# EAGLE schematic OLM_OS_v142 (EAGLE 6.4)
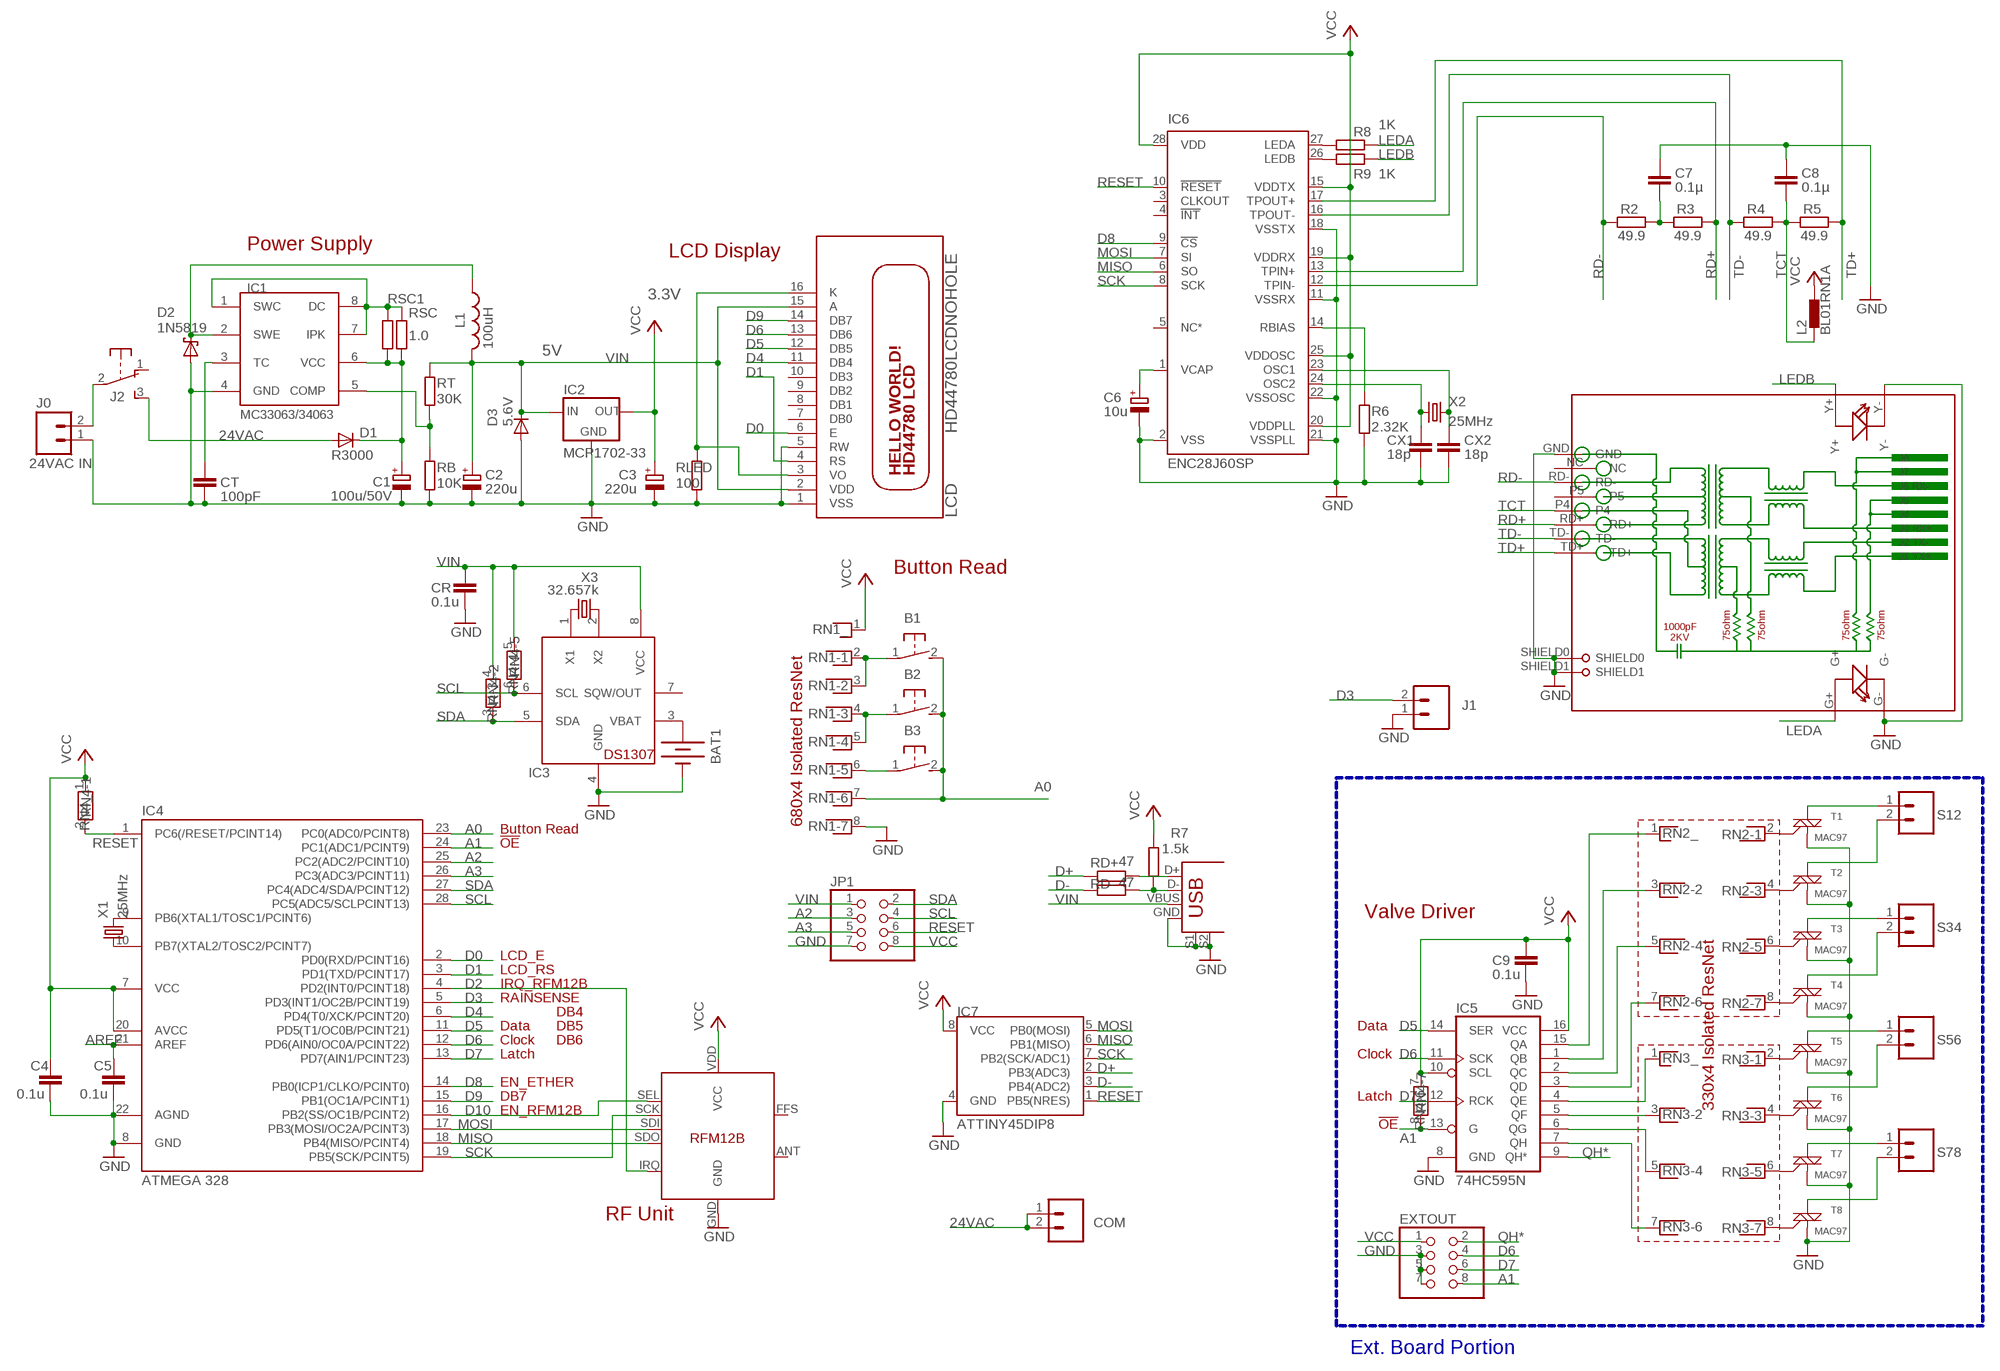
[diagram p0: schematic, sheet 1]

## Parts
B1  31-XX  [B3F-31XX]
B2  31-XX  [B3F-31XX]
B3  31-XX  [B3F-31XX]
BAT1  BATTERY12PTH  [BATTCON_12MM_PTH]
C1  100u/50V  CPOL-EUE3.5-8  [E3,5-8]
C2  220u  CPOL-EUE2-5  [E2-5]
C3  220u  CPOL-EUE2-5  [E2-5]
C4  0.1u  C-EU025-024X044  [C025-024X044]
C5  0.1u  C-EU025-024X044  [C025-024X044]
C6  10u  CPOL-EUE1.8-4  [E1,8-4]
C7  0.1µ  C-EU025-024X044  [C025-024X044]
C8  0.1µ  C-EU025-024X044  [C025-024X044]
C9  0.1u  C-EU025-024X044  [C025-024X044]
COM  M025MM  [SCREWTERMINAL-5MM-2]
CR  0.1u  C-EU025-024X044  [C025-024X044]
CT  100pF  C-EU025-024X044  [C025-024X044]
CX1  18p  C-EU025-024X044  [C025-024X044]
CX2  18p  C-EU025-024X044  [C025-024X044]
D1  R3000  DIODE-DO41-7.6  [DO41-7.6]
D2  1N5819  1N5817-B  [DO41-7.6]
D3  5.6V  1N4148DO35-7  [DO35-7]
EXTOUT  PINHD-2X4  [2X04]
IC1  MC33063/MC34063P  [DIL08]
IC2  MCP1702-33  MCP1700INLINE  [TO92-INLINE]
IC3  DS1307  [DIL08]
IC4  ATMEGA 328  ATMEGA48/88/168-PU  [DIL28-3]
IC5  74HC595N  74LS595N  [DIL16]
IC6  ENC28J60SP  [DIL28-3]
IC7  ATTINY45DIP8  [DIP08]
IC8  RFM12B  [RFM12B]
J0  24VAC IN  M025MM  [SCREWTERMINAL-5MM-2]
J1  M025MM  [SCREWTERMINAL-5MM-2]
J2  EG1206  [EG1206]
JP1  PINHD-2X4  [2X04]
L1  100uH  L-US6000-XXX-RC  [6000-XXXX-RC]
L2  BL01RN1A  [BL01RN1A]
LCD  HD44780LCDNOHOLE  [LCD1602A]
R2  49.9  R-EU_0204/7  [0204/7]
R3  49.9  R-EU_0204/7  [0204/7]
R4  49.9  R-EU_0204/7  [0204/7]
R5  49.9  R-EU_0204/7  [0204/7]
R6  2.32K  R-EU_0204/7  [0204/7]
R7  1.5k  R-EU_0204/7  [0204/7]
R8  1K  R-EU_0204/7  [0204/7]
R9  1K  R-EU_0204/7  [0204/7]
RB  10K  R-EU_0204/7  [0204/7]
RD+  47  R-EU_0204/7  [0204/7]
RD-  47  R-EU_0204/7  [0204/7]
RJ1  HR911105A  [HR911105A]
RLED  100  R-EU_0204/7  [0204/7]
RN1  RNX7  [RN-8]
RN2  RNX7  [RN-8]
RN3  RNX7  [RN-8]
RN4  RNX7  [RN-8]
RSC  1.0  R-EU_0204/7  [0204/7]
RSC1  1.0  R-EU_0204/7  [0204/7]
RT  30K  R-EU_0204/7  [0204/7]
S12  M025MM  [SCREWTERMINAL-5MM-2]
S34  M025MM  [SCREWTERMINAL-5MM-2]
S56  M025MM  [SCREWTERMINAL-5MM-2]
S78  M025MM  [SCREWTERMINAL-5MM-2]
T1  MAC97  LX807DE  [TO-92]
T2  MAC97  LX807DE  [TO-92]
T3  MAC97  LX807DE  [TO-92]
T4  MAC97  LX807DE  [TO-92]
T5  MAC97  LX807DE  [TO-92]
T6  MAC97  LX807DE  [TO-92]
T7  MAC97  LX807DE  [TO-92]
T8  MAC97  LX807DE  [TO-92]
USB  USB+SHIELD  [USB-B-PTH]
X1  25MHz  CRYSTALHC49US  [HC49US]
X2  25MHz  CRYSTALHC49US  [HC49US]
X3  32.657k  CRYSTALTC26H  [TC26H]

## Nets
24VAC [power]: COM.1 COM.2 D1.A J2.3(S)
A0: B1.2(S) B2.2(S) B3.2(S) IC4.23(PC0(ADC0/PCINT8)) RN1.7
A1: EXTOUT.8 IC4.24(PC1(ADC1/PCINT9)) IC5.13(G) RN4.8
A2: IC4.25(PC2(ADC2/PCINT10)) JP1.3
A3: IC4.26(PC3(ADC3/PCINT11)) JP1.5
AREF: C5.1 IC4.21(AREF)
D0: IC4.2(PD0(RXD/PCINT16)) LCD.6(E)
D1: IC4.3(PD1(TXD/PCINT17)) LCD.4(RS)
D2: IC4.4(PD2(INT0/PCINT18)) IC8.IRQ
D3: IC4.5(PD3(INT1/OC2B/PCINT19)) J1.2
D4: IC4.6(PD4(T0/XCK/PCINT20)) LCD.11(DB4)
D5: IC4.11(PD5(T1/OC0B/PCINT21)) IC5.14(SER) LCD.12(DB5)
D6: EXTOUT.4 IC4.12(PD6(AIN0/OC0A/PCINT22)) IC5.11(SCK) LCD.13(DB6)
D7: EXTOUT.6 IC4.13(PD7(AIN1/PCINT23)) IC5.12(RCK)
D8: IC4.14(PB0(ICP1/CLKO/PCINT0)) IC6.9(!CS)
D9: IC4.15(PB1(OC1A/PCINT1)) LCD.14(DB7)
D10: IC4.16(PB2(SS/OC1B/PCINT2)) IC8.SEL
D+: IC7.2(PB3(ADC3)) RD+.1
D-: IC7.3(PB4(ADC2)) RD-.1
GND [power]: BAT1.GND(-) C1.- C2.- C3.- C4.2 C5.2 C6.- C7.1 C8.1 C9.2 CR.2 CT.2 CX1.2 CX2.2 D2.A D3.A EXTOUT.3 EXTOUT.5 EXTOUT.7 IC1.4(GND) IC2.1(GND) IC3.4(GND) IC4.8(GND) IC4.22(AGND) IC5.8(GND) IC6.2(VSS) IC6.11(VSSRX) IC6.18(VSSTX) IC6.21(VSSPLL) IC6.22(VSSOSC) IC7.4(GND) IC8.GND J0.1 J1.1 JP1.7 LCD.1(VSS) LCD.5(RW) R6.2 RB.2 RJ1.G- RJ1.GND RJ1.SHIELD0 RJ1.SHIELD1 RJ1.Y- RLED.2 RN1.8 T1.1(M1) T2.1(M1) T3.1(M1) T4.1(M1) T5.1(M1) T6.1(M1) T7.1(M1) T8.1(M1) USB.GND USB.S1 USB.S2
LEDA: R8.2 RJ1.G+
LEDB: R9.2 RJ1.Y+
MISO: IC4.18(PB4(MISO/PCINT4)) IC6.6(SO) IC7.6(PB1(MISO)) IC8.SDO
MOSI: IC4.17(PB3(MOSI/OC2A/PCINT3)) IC6.7(SI) IC7.5(PB0(MOSI)) IC8.SDI
N$2: IC4.9(PB6(XTAL1/TOSC1/PCINT6)) X1.2
N$3: RN2.2 T1.2(G)
N$4: IC5.5(QF) RN3.3
N$5: IC5.6(QG) RN3.5
N$6 [power]: J0.2 J2.2(P)
N$7: IC5.7(QH) RN3.7
N$8: IC4.10(PB7(XTAL2/TOSC2/PCINT7)) X1.1
N$9 [power]: C1.+ D1.C IC1.6(VCC) RSC1.2 RSC.2
N$10: IC5.4(QE) RN3.1
N$11: IC5.3(QD) RN2.7
N$12: IC5.2(QC) RN2.5
N$13: IC5.1(QB) RN2.3
N$14: IC5.15(QA) RN2.1
N$15: RN2.4 T2.2(G)
N$16 [power]: S12.1 T1.3(M2)
N$17 [power]: S12.2 T2.3(M2)
N$18 [power]: S34.1 T3.3(M2)
N$19: RN2.6 T3.2(G)
N$20 [power]: S34.2 T4.3(M2)
N$21: RN2.8 T4.2(G)
N$22 [power]: S56.1 T5.3(M2)
N$23 [power]: S56.2 T6.3(M2)
N$24 [power]: S78.1 T7.3(M2)
N$25 [power]: S78.2 T8.3(M2)
N$26: RN3.2 T5.2(G)
N$27: RN3.4 T6.2(G)
N$28: RN3.6 T7.2(G)
N$29: RN3.8 T8.2(G)
N$32: B1.1(P) RN1.2 RN1.3
N$33: B3.1(P) RN1.6
N$35: B2.1(P) RN1.4 RN1.5
N$36: BAT1.VCC@1(+) IC3.3(VBAT)
N$37: IC6.27(LEDA) R8.1
N$38: RD+.2 USB.D+
N$39: IC6.26(LEDB) R9.1
N$40 [power]: IC1.1(SWC) IC1.7(IPK) IC1.8(DC) RSC1.1 RSC.1
N$45: R7.1 RD-.2 USB.D-
N$46 [power]: D2.C IC1.2(SWE) L1.1
N$47: IC3.2(X2) X3.2
N$48: LCD.3(VO) LCD.16(K) RLED.1
N$49: CT.1 IC1.3(TC)
N$50: C6.+ IC6.1(VCAP)
N$51: IC6.14(RBIAS) R6.1
N$52: CX1.1 IC6.24(OSC2) X2.1
N$53: CX2.1 IC6.23(OSC1) X2.2
N$54: C7.2 R2.2 R3.1
N$55: IC1.5(COMP) RB.1 RT.2
N$57: IC3.1(X1) X3.1
QH*: EXTOUT.2 IC5.9(QH*)
RD+: IC6.13(TPIN+) R3.2 RJ1.RD+
RD-: IC6.12(TPIN-) R2.1 RJ1.RD-
RESET: IC4.1(PC6(/RESET/PCINT14)) IC6.10(!RESET) IC7.1(PB5(NRES)) JP1.6 RN4.2
SCK: IC4.19(PB5(SCK/PCINT5)) IC6.8(SCK) IC7.7(PB2(SCK/ADC1)) IC8.SCK
SCL: IC3.6(SCL) IC4.28(PC5(ADC5/SCLPCINT13)) JP1.4 RN4.6
SDA: IC3.5(SDA) IC4.27(PC4(ADC4/SDA/PCINT12)) JP1.2 RN4.3
TCT: C8.2 L2.1 R4.2 R5.1 RJ1.P4
TD+: IC6.17(TPOUT+) R5.2 RJ1.TD+
TD-: IC6.16(TPOUT-) R4.1 RJ1.TD-
VCC: C3.+ C4.1 C9.1 EXTOUT.1 IC2.3(OUT) IC4.7(VCC) IC4.20(AVCC) IC5.10(SCL) IC5.16(VCC) IC6.15(VDDTX) IC6.19(VDDRX) IC6.20(VDDPLL) IC6.25(VDDOSC) IC6.28(VDD) IC7.8(VCC) IC8.VDD(VCC) JP1.8 L2.2 R7.2 RN1.1 RN4.1 RN4.7
VIN [power]: C2.+ CR.1 D3.C IC2.2(IN) IC3.8(VCC) JP1.1 L1.2 LCD.2(VDD) LCD.15(A) RN4.4 RN4.5 RT.1 USB.VBUS
Unconnected: IC3.7(SQW/OUT) IC6.3(CLKOUT) IC6.4(!INT) IC6.5(NC*) IC8.ANT IC8.FFS J2.1(O) LCD.7(DB0) LCD.8(DB1) LCD.9(DB2) LCD.10(DB3) RJ1.NC RJ1.P5

## Buses
B$1

## Notes on the sheet
- Power Supply
- LCD Display
- 3.3V
- 5V
- Button Read
- 680x4 Isolated ResNet
- Button Read
- !OE
- Valve Driver
- 330x4 Isolated ResNet
- LCD_E
- LCD_RS
- IRQ_RFM12B
- RAINSENSE
- DB4
- Data | DB5 | Data
- Clock | DB6
- Latch | Clock
- EN_ETHER
- DB7 | Latch
- EN_RFM12B
- !OE
- RF Unit
- Ext. Board Portion

## Library data of the parts
B1-B3 = adafruit:31-XX: OMRON SWITCH Now with beefier pads!
BAT1 = SparkFun:BATTERY: Battery Holders Various common sizes : AA, AAA, 20mm coin cell and 12mm coin cell.
C1-C3 C6 = resistor:CPOL-EU: POLARIZED CAPACITOR, European symbol
C4 C5 C9 CR CT = rcl:C-EU: CAPACITOR, European symbol
C7 C8 CX1 CX2 = resistor:C-EU: CAPACITOR, European symbol
COM J0 J1 S12 S34 S56 S78 = SparkFun:M02: Header 2 Standard 2-pin 0.1" header. Use with straight break away headers (SKU : PRT-00116), right angle break away headers (PRT-00553), swiss pins (PRT-00743), machine pins (PRT-00117), and female headers (PRT-00115). Molex polarized connector foot print use with SKU : PRT-08233 with associated crimp pins and housings.
D1 = diode:DIODE-: DIODE
D2 = diode:1N581*: 1.0A SCHOTTKY BARRIER RECTIFIER Source: http://www.diodes.com/datasheets/ds23001.pdf
D3 = diode:1N4148: DIODE high speed (Philips)
EXTOUT JP1 = pinhead:PINHD-2X4: PIN HEADER
IC1 = adafruit:MC33063/MC34063: MC33063 and MC34063 Basic DC/DC converter with internal power-NPN transistor, 100KHz, 1.5A peak switch current. 3-40 input/output.
IC2 = adafruit:MCP1700: VOLTAGE REGULATOR
IC3 = adafruit:DS1307: DS1307 Real time clock (RTC) with battery backup ability. Talk to it via i2c
IC4 = atmega8:ATMEGA48/88/168-PU
IC5 = SparkFun:74*595: 8-bit SHIFT REGISTER, output latch
IC6 = microchip:ENC28J60: Stand-Alone Ethernet Controller with SPI Interface Source: http://ww1.microchip.com/downloads/en/DeviceDoc/39662c.pdf; MF: MICROCHIP; MPN: ENC28J60/SP; OC_FARNELL: 1084619; OC_NEWARK: 96K3661
IC7 = SparkFun:ATTINY45: Atmel ATTiny45
IC8 = JeeLabs:RFM12B
J2 = adafruit:EG1206
L1 = rcl:L-US: INDUCTOR, American symbol
L2 = inductors:BL0: Noise Suppression Products/EMI Suppression Filters, Lead EMIFIL(R) Inductor Type Source: http://www.murata.com .. BL01RN1_DS.pdf
LCD = adafruit:HD44780LCD: HD44780 LCD Standard character type LCDs, available in sizes from 8x1 to 40x4!
R2-R9 RB RD+ RD- RLED RSC RSC1 RT = rcl:R-EU_: RESISTOR, European symbol
RJ1 = CONNECTER:HR911105A
RN1-RN4 = resistor-net:RNX7: RESISTOR NETWORK; OC_FARNELL: unknown; OC_NEWARK: unknown
T1-T8 = SparkFun:LX807DE: LX807DE Triac http://www.littelfuse.com/data/en/Data_Sheets/Littelfuse_Triac_LX8.pdf
USB = SparkFunNew:USB+SHIELD: USB+Shield USB connector with shield pins connectable
X1 X2 = SparkFun:CRYSTAL: Crystals Various standard crystals. Proven footprints. Spark Fun Electronics SKU : COM-00534
X3 = crystal:CRYSTAL: CRYSTAL; OC_FARNELL: unknown; OC_NEWARK: unknown

## Net classes
0 default: width 0.305 mm, clearance 0.203 mm
1 power: width 0.813 mm, clearance 0.203 mm